# EAGLE design PocaSeek (EAGLE 9.6.2)
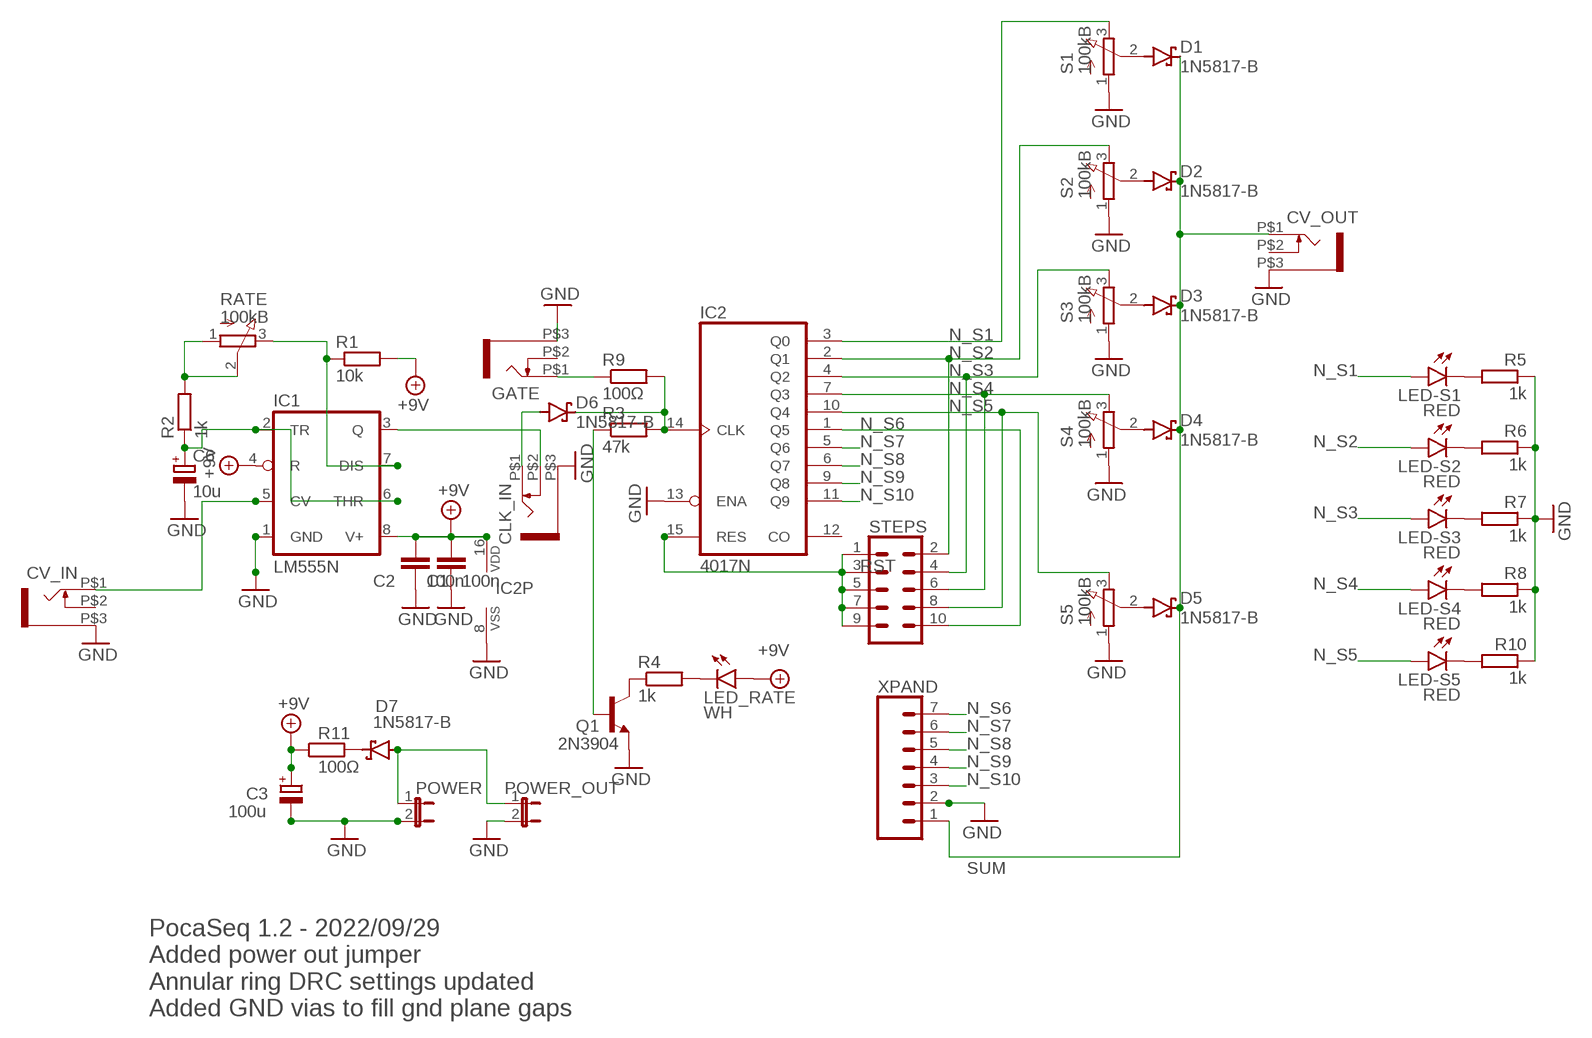
[diagram p0: schematic, sheet 1]

## Parts
C1  100n  C-EU050-024X044  [C050-024X044]
C2  100n  C-EU050-024X044  [C050-024X044]
C3  100u  CPOL-EUE2.5-7  [E2,5-7]
C6  10u  CPOL-EUE2.5-6  [E2,5-6]
CLK_IN  WQP-PJ301M-12_JACK  [WQP-PJ301M-12_JACK]
CV_IN  WQP-PJ301M-12_JACK  [WQP-PJ301M-12_JACK]
CV_OUT  WQP-PJ301M-12_JACK  [WQP-PJ301M-12_JACK]
D1  1N5817-B  [DO41-7.6]
D2  1N5817-B  [DO41-7.6]
D3  1N5817-B  [DO41-7.6]
D4  1N5817-B  [DO41-7.6]
D5  1N5817-B  [DO41-7.6]
D6  1N5817-B  [DO41-7.6]
D7  1N5817-B  [DO41-7.6]
GATE  WQP-PJ301M-12_JACK  [WQP-PJ301M-12_JACK]
IC1  LM555N  [DIL08]
IC2  4017N  [DIL16]
LED-S1  RED  LED3MM  [LED3MM]
LED-S2  RED  LED3MM  [LED3MM]
LED-S3  RED  LED3MM  [LED3MM]
LED-S4  RED  LED3MM  [LED3MM]
LED-S5  RED  LED3MM  [LED3MM]
LED_RATE  WH  LED3MM  [LED3MM]
POWER  JP1E  [JP1]
POWER_OUT  JP1E  [JP1]
Q1  2N3904  [TO92]
R1  10k  R-EU_0204/7  [0204/7]
R2  1k  R-EU_0204/7  [0204/7]
R3  47k  R-EU_0204/7  [0204/7]
R4  1k  R-EU_0204/7  [0204/7]
R5  1k  R-EU_0204/2V  [0204V]
R6  1k  R-EU_0204/2V  [0204V]
R7  1k  R-EU_0204/2V  [0204V]
R8  1k  R-EU_0204/2V  [0204V]
R9  100Ω  R-EU_0204/7  [0204/7]
R10  1k  R-EU_0204/2V  [0204V]
R11  100Ω  R-EU_0204/7  [0204/7]
RATE  100kB  EVUF3M  [EVUFXM]
S1  100kB  EVUF3M  [EVUFXM]
S2  100kB  EVUF3M  [EVUFXM]
S3  100kB  EVUF3M  [EVUFXM]
S4  100kB  EVUF3M  [EVUFXM]
S5  100kB  EVUF3M  [EVUFXM]
STEPS  CONN_05X2PTH  [2X5]
XPAND  CONN_07LOCK  [1X07_LOCK]

## Nets
+9V: C1.1 C2.1 C3.+ IC1.4(R) IC1.8(V+) IC2.16(VDD) LED_RATE.A R1.2 R11.1
GND: C1.2 C2.2 C3.- C6.- CLK_IN.P$3 CV_IN.P$3 CV_OUT.P$3 GATE.P$3 IC1.1(GND) IC2.8(VSS) IC2.13(ENA) POWER.2 POWER_OUT.2 Q1.3(E) R5.1 R6.1 R7.1 R8.1 R10.1 S1.1(A) S2.1(A) S3.1(A) S4.1(A) S5.1(A) XPAND.2
N$1: D1.A S1.2(S)
N$2: CLK_IN.P$2 IC1.3(Q)
N$3: D2.A S2.2(S)
N$4: D6.C IC2.14(CLK) R3.2 R9.2
N$5: D5.A S5.2(S)
N$6: LED-S1.K(C) R5.2
N$7: GATE.P$1 R9.1
N$8: D3.A S3.2(S)
N$9: D4.A S4.2(S)
N$11: R2.2 RATE.1(A) RATE.2(S)
N$12: LED-S3.K(C) R7.2
N$13: Q1.2(B) R3.1
N$14: CLK_IN.P$1 D6.A
N$15: CV_IN.P$1 IC1.5(CV)
N$16: C6.+ IC1.2(TR) IC1.6(THR) R2.1
N$17: IC1.7(DIS) R1.1 RATE.3(E)
N$18: LED-S4.K(C) R8.2
N$19: Q1.1(C) R4.1
N$20: LED_RATE.K(C) R4.2
N$21: LED-S5.K(C) R10.2
N$22: LED-S2.K(C) R6.2
N$23: D7.C R11.2
N$24: D7.A POWER.1 POWER_OUT.1
N_S1: IC2.3(Q0) LED-S1.A S1.3(E)
N_S2: IC2.2(Q1) LED-S2.A S2.3(E) STEPS.2
N_S3: IC2.4(Q2) LED-S3.A S3.3(E) STEPS.4
N_S4: IC2.7(Q3) LED-S4.A S4.3(E) STEPS.6
N_S5: IC2.10(Q4) LED-S5.A S5.3(E) STEPS.8
N_S6: IC2.1(Q5) STEPS.10 XPAND.7
N_S7: IC2.5(Q6) XPAND.6
N_S8: IC2.6(Q7) XPAND.5
N_S9: IC2.9(Q8) XPAND.4
N_S10: IC2.11(Q9) XPAND.3
RST: IC2.15(RES) STEPS.1 STEPS.3 STEPS.5 STEPS.7 STEPS.9
SUM: CV_OUT.P$1 D1.C D2.C D3.C D4.C D5.C XPAND.1
Unconnected: CV_IN.P$2 CV_OUT.P$2 GATE.P$2 IC2.12(CO)

## Notes on the sheet
- PocaSeq 1.2 - 2022/09/29
  Added power out jumper
  Annular ring DRC settings updated
  Added GND vias to fill gnd plane gaps

## Library data of the parts
C1 C2 = resistor:C-EU: CAPACITOR, European symbol
C3 C6 = rcl:CPOL-EU: POLARIZED CAPACITOR, European symbol
CLK_IN CV_IN CV_OUT GATE = thonkiconn:WQP-PJ301M-12_JACK
D1-D7 = diode:1N581*: 1.0A SCHOTTKY BARRIER RECTIFIER Source: http://www.diodes.com/datasheets/ds23001.pdf
IC1 = linear:*555: TIMER
IC2 = 40xx:4017: COUNTER/DIVIDER
LED-S1-LED-S5 LED_RATE = gm-diodes:LED
POWER POWER_OUT = jumper:JP1E: JUMPER
Q1 = transistor:2N3904: NPN TRANSISTOR
R1-R11 = resistor:R-EU_: RESISTOR, European symbol
RATE S1-S5 = AFA-TUTCOMP:EVU: 9 mm Square Rotary Potentiometers Source: Panasonic
STEPS = SparkFun-Connectors:CONN_05X2: Multi connection point. Often used as Generic Header-pin footprint for 0.1 inch spaced/style header connections For AVR SPI programming port, see special device with nice symbol: "AVR_SPI_PROG_5x2.dev" You can populate with any combo of single row headers, but if you'd like an exact match, check these: 2x5 AVR ICSP Male Header <https://www.sparkfun.com/products/778> (PRT-00778) 2x5 Pin Shrouded Header <https://www.sparkfun.com/products/8506> (PRT-08506) On any of the 0.1 inch spaced packages, you can populate with these: Break Away Headers - Straight <https://www.sparkfun.com/products/116> (PRT-00116) Break Away Male Headers - Right Angle <https://www.sparkfun.com/products/553> (PRT-00553) Female Headers <https://www.sparkfun.com/products/115> (PRT-00115) Break Away Headers - Machine Pin <https://www.sparkfun.com/products/117> (PRT-00117) Break Away Female Headers - Swiss Machine Pin <https://www.sparkfun.com/products/743> (PRT-00743) Special note: the shrouded connector mates well with our 5x2 ribbon cables: 2x5 Pin IDC Ribbon Cable <https://www.sparkfun.com/products/8535> (PRT-08535); PROD_ID: CONN-08499; SF_ID: PRT-0778
XPAND = SparkFun-Connectors:CONN_07: Multi connection point. Often used as Generic Header-pin footprint for 0.1 inch spaced/style header connections On any of the 0.1 inch spaced packages, you can populate with these: Break Away Headers - Straight <https://www.sparkfun.com/products/116> (PRT-00116) Break Away Male Headers - Right Angle <https://www.sparkfun.com/products/553> (PRT-00553) Female Headers <https://www.sparkfun.com/products/115> (PRT-00115) Break Away Headers - Machine Pin <https://www.sparkfun.com/products/117> (PRT-00117) Break Away Female Headers - Swiss Machine Pin <https://www.sparkfun.com/products/743> (PRT-00743) For SCREWTERMINALS and SPRING TERMINALS visit here: Screw Terimnals on SparkFun.com <https://www.sparkfun.com/search/results?term=Screw+Terminals> (5mm/3.5mm/2.54mm spacing) This device is also useful as a general connection point to wire up your design to another part of your project. Our various solder wires solder well into these plated through hole pads. Hook-Up Wire - Assortment (Stranded, 22 AWG) <https://www.sparkfun.com/products/11375> (PRT-11375) Hook-Up Wire - Assortment (Solid Core, 22 AWG) <https://www.sparkfun.com/products/11367> (PRT-11367) View the entire wire category on our website here <https://www.sparkfun.com/categories/141> Special notes: Molex polarized connector foot print use with SKU : PRT-08231 with associated crimp pins and housings. 1MM SMD Version SKU: PRT-10208 NOTES ON THE VARIANTS LOCK and LOCK_LONGPADS... This footprint was designed to help hold the alignment of a through-hole component (i.e. 6-pin header) while soldering it into place. You may notice that each hole has been shifted either up or down by 0.005 of an inch from it's more standard position (which is a perfectly straight line). This slight alteration caused the pins (the squares in the middle) to touch the edges of the holes. Because they are alternating, it causes a "brace" to hold the component in place. 0.005 has proven to be the perfect amount of "off-center" position when using our standard breakaway headers. Although looks a little odd when you look at the bare footprint, once you have a header in there, the alteration is very hard to notice. Also,if you push a header all the way into place, it is covered up entirely on the bottom side.

## Board
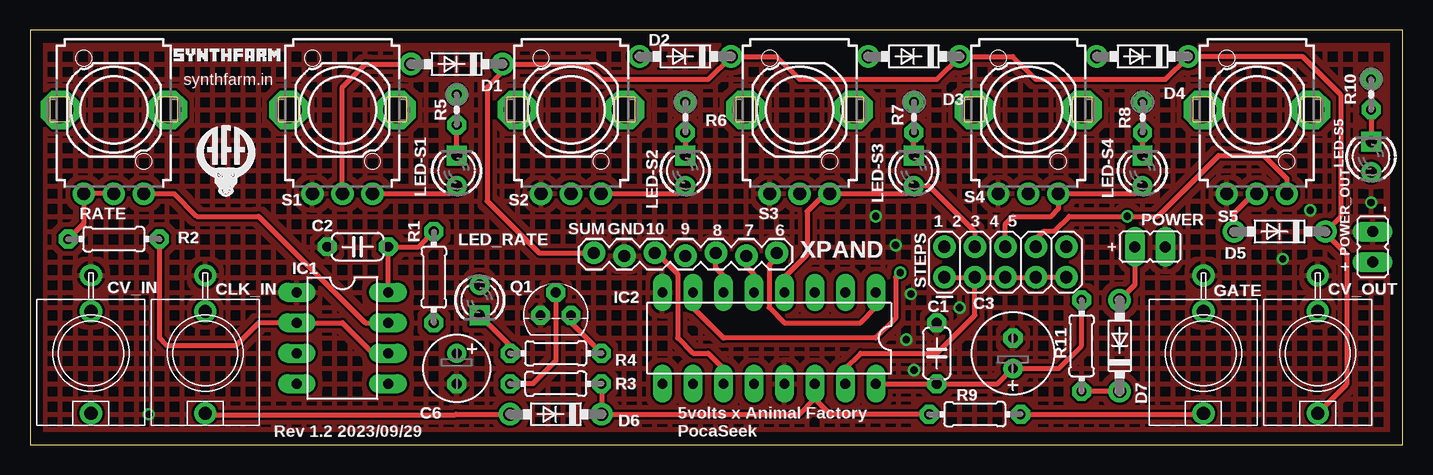
[diagram p1: board, top side]
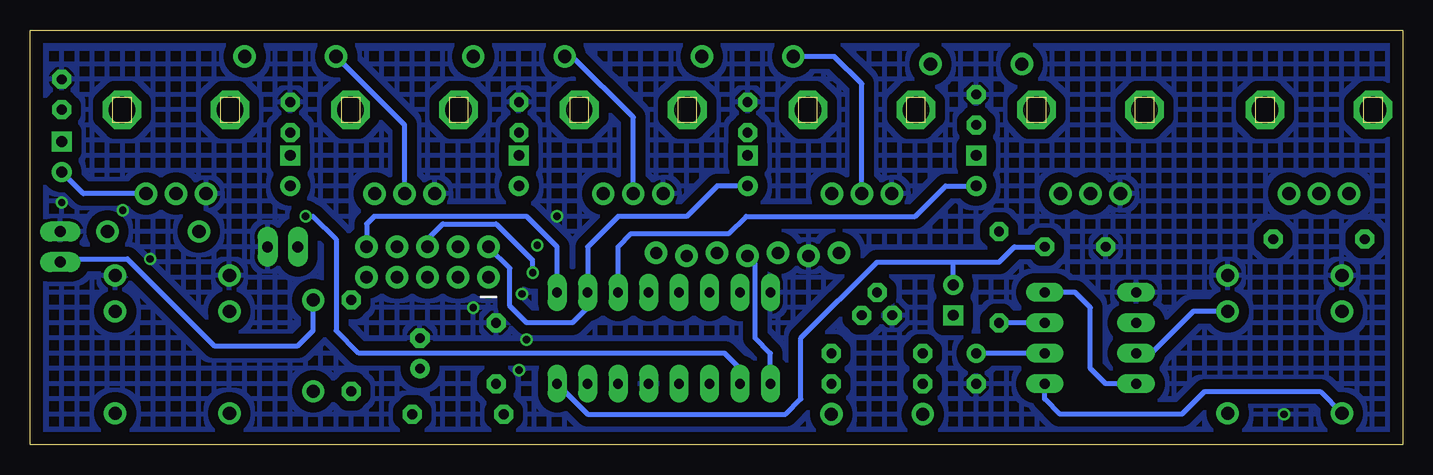
[diagram p2: board, bottom side, seen from below]

Size 114.41 x 34.59 mm. Coordinates in mm from the lower left corner, seen from the top.
Outline: 0,0 114.41,0 114.41,34.59 0,34.59 0,0
Copper layers (1*16): Top 0.035mm / dielectric 1.5mm / Bottom 0.035mm
Design rules "default *": minimum track width 10mil, minimum drill 24mil, track to track 8mil, track to pad 8mil, pad to pad 8mil, via to via 8mil, smd to smd 8mil, copper to edge 40mil, drill to drill 8mil, minimum pad ring 15mil, minimum via ring 8mil, stop-mask expansion 4mil, vias tented up to drill 0mil, thermal gap 10mil

### Footprints (pad centres in the part's own frame; a part is rotated, then mirrored left to right if it is on the bottom)
C050-024X044 = drill 0.813 octagon: 1 -2.54,0; 2 2.54,0
E2,5-7 = drill 0.813 pad 1.6: + -1.27,0 | drill 0.813 pad 1.6 octagon: - 1.27,0
E2,5-6 = drill 0.813 pad 1.6: + -1.27,0 | drill 0.813 pad 1.6 octagon: - 1.27,0
WQP-PJ301M-12_JACK = drill 1.1: P$1 0,5; P$2 0,-3.5; P$3 0,-6.5
DO41-7.6 = drill 1.1 pad 1.7: A 3.81,0; C -3.81,0
DIL08 = drill 0.813 long: 1 -3.81,-3.81; 2 -1.27,-3.81; 3 1.27,-3.81; 4 3.81,-3.81; 5 3.81,3.81; 6 1.27,3.81; 7 -1.27,3.81; 8 -3.81,3.81
DIL16 = drill 0.813 long: 1 -8.89,-3.81; 2 -6.35,-3.81; 3 -3.81,-3.81; 4 -1.27,-3.81; 5 1.27,-3.81; 6 3.81,-3.81; 7 6.35,-3.81; 8 8.89,-3.81; 9 8.89,3.81; 10 6.35,3.81; 11 3.81,3.81; 12 1.27,3.81; 13 -1.27,3.81; 14 -3.81,3.81; 15 -6.35,3.81; 16 -8.89,3.81
LED3MM = drill 0.9: A -1.27,0 | drill 0.9 square: K 1.27,0
JP1 = drill 0.914 long: 1 0,-1.27; 2 0,1.27
TO92 = drill 0.813 octagon: 1 1.27,0; 2 0,1.905; 3 -1.27,0
0204/7 = drill 0.813 octagon: 1 -3.81,0; 2 3.81,0
0204V = drill 0.813 octagon: 1 -1.27,0; 2 1.27,0
EVUFXM = drill 1.1 pad 1.676: 1 -2.5,-7; 2 0,-7; 3 2.5,-7 | drill 2.2 pad 3.2 octagon: M1 4.5,0; M2 -4.5,0
2X5 = drill 1.016 pad 1.88: 1 0,0; 2 0,2.54; 3 2.54,0; 4 2.54,2.54; 5 5.08,0; 6 5.08,2.54; 7 7.62,0; 8 7.62,2.54; 9 10.16,0; 10 10.16,2.54
1X07_LOCK = drill 1.016 pad 1.88: 1 0,0.127; 2 2.54,-0.127; 3 5.08,0.127; 4 7.62,-0.127; 5 10.16,0.127; 6 12.7,-0.127; 7 15.24,0.127

### Placement (x,y rotation side)
C1  75.56,7.62 90 top
C2  27.3,16.51 180 top
C3  81.92,7.62 90 top
C6  35.56,6.35 270 top
CLK_IN  14.61,7.62 180 top
CV_IN  5.08,7.62 180 top
CV_OUT  107.31,7.62 180 top
D1  35.56,31.75 180 top
D2  54.61,32.38 180 top
D3  73.66,32.38 180 top
D4  92.71,32.38 180 top
D5  104.14,17.78 180 top
D6  43.81,2.54 180 top
D7  90.81,8.26 90 top
GATE  97.79,7.62 180 top
IC1  26.04,8.89 270 top
IC2  61.59,8.89 180 top
LED-S1  35.56,22.86 90 top
LED-S2  54.61,22.86 90 top
LED-S3  73.66,22.86 90 top
LED-S4  92.71,22.86 90 top
LED-S5  111.76,24 90 top
LED_RATE  37.47,12.06 270 top
POWER  93.34,16.51 270 top
POWER_OUT  111.89,16.51 0 top
Q1  43.81,10.79 0 top
R1  33.66,13.97 90 top
R2  6.99,17.14 180 top
R3  43.81,5.08 0 top
R4  43.81,7.62 180 top
R5  35.56,27.94 270 top
R6  54.61,27.3 270 top
R7  73.66,27.3 270 top
R8  92.71,27.3 270 top
R9  78.74,2.54 180 top
R10  111.76,29.21 270 top
R11  87.63,8.26 270 top
RATE  6.99,27.94 0 top
S1  26.04,27.94 0 top
S2  45.09,27.94 0 top
S3  64.14,27.94 0 top
S4  83.19,27.94 0 top
S5  102.23,27.94 0 top
STEPS  76.2,13.97 0 top
XPAND  46.99,15.88 0 top

### Tracks (layer width: path | path; a pad name or v marks a point on that pad's centre or on a via)
+9V
  Top 0.406: IC2.16 C1.1 80.64,5.08 C3.+ 85.72,6.35 87.63,8.26 R11.1 | IC1.8 C2.1 32.38,16.51 R1.2
  Bottom 0.406: IC1.4 24.77,5.08 26.04,6.35 26.04,11.43 27.3,12.7 IC1.8 | IC2.16 67.94,2.54 51.44,2.54 50.16,3.81 50.16,8.89 43.81,15.24 37.47,15.24 | C2.1 32.38,16.51 33.66,15.24 37.47,15.24 | LED_RATE.A 37.47,15.24
GND  (via drill 0.61)
  other vias: 73.03,8.76 73.66,6.22 77.47,11.43 70.48,19.05 9.91,2.54 72.14,16.64 73.41,12.57 104.39,15.49 111.76,20.19 106.68,19.56
  pour Bottom (isolate 0.813, hatched): 0.64,34.29 0.64,0 114.3,0 114.3,34.29
  pour Top (hatched): 114.3,34.29 0.64,34.29 0.64,0 arc1 114.3,0
N$1
  Top 0.406: S1.2 26.04,29.84 27.94,31.75 D1.A
N$2
  Bottom 0.406: CLK_IN.P$2 17.45,11.12 20.95,7.62 IC1.3
N$3
  Bottom 0.406: S2.2 45.09,30.1 47.37,32.38 D2.A
N$4
  Top 0.406: 65.41,3.81 64.14,2.54 D6.C R3.2 | 65.41,3.81 IC2.14 | R9.2 66.67,2.54 65.41,3.81
N$5
  Top 0.406: S5.2 101.98,20.94 100.33,19.29 D5.A
N$6
  Top 0.406: LED-S1.K R5.2
N$7
  Top 0.406: GATE.P$1 97.71,2.54 R9.1
N$8
  Bottom 0.406: S3.2 64.14,27.3 69.22,32.38 D3.A
N$9
  Bottom 0.406: S4.2 83.19,26.67 D4.A
N$11
  Top 0.406: R2.2 4.49,18.45 RATE.1 RATE.2
N$12
  Top 0.406: LED-S3.K R7.2
N$13
  Top 0.406: Q1.2 43.81,6.99 41.91,5.08 R3.1
N$14
  Top 0.406: CLK_IN.P$1 14.72,2.5 35.47,2.5 35.51,2.54 D6.A
N$15
  Bottom 0.406: IC1.5 29.84,3.81 28.57,2.54 18.41,2.54 16.51,4.45 6.91,4.45 CV_IN.P$1
N$16
  Top 0.406: IC1.6 28.57,7.62 26.04,10.16 IC1.2 19.05,10.16 17.14,8.26 11.43,8.26 10.79,8.89 R2.1
  Bottom 0.406: IC1.6 C6.+
N$17
  Top 0.406: RATE.3 12.03,20.94 13.91,19.05 19.05,19.05 27.94,10.16 IC1.7
  Bottom 0.406: IC1.7 R1.1
N$18
  Top 0.406: LED-S4.K R8.2
N$19
  Top 0.406: R4.1 45.09,10.16 Q1.1
N$20
  Top 0.406: LED_RATE.K 40.01,8.26 R4.2
N$21
  Top 0.406: R10.2 LED-S5.K
N$22
  Top 0.406: R6.2 LED-S2.K
N$23
  Top 0.406: D7.C R11.2
N$24
  Top 0.406: POWER.1 92.08,13.34 D7.A
  Bottom 0.406: POWER_OUT.1 111.63,15.49 106.3,15.49 99.06,8.26 92.08,8.26 90.81,9.53 D7.A
N_S1
  Top 0.406: S1.3 34.91,20.94 LED-S1.A
  Bottom 0.406: IC2.3 65.41,16.51 64.31,17.6 56.18,17.6 54.73,19.05 40.64,19.05 38.1,21.59 LED-S1.A
N_S2
  Top 0.406: S2.3 53.96,20.94 LED-S2.A
  Bottom 0.406: LED-S2.A 57.15,21.59 59.69,19.05 65.41,19.05 67.94,16.51 IC2.2 67.94,11.43 69.22,10.16 73.03,10.16 74.42,11.56 74.42,14.73 STEPS.2
N_S3
  Top 0.406: STEPS.4 78.74,17.78 74.93,21.59 LED-S3.A 73.01,20.94 S3.3 66.25,20.94 64.77,19.46 64.77,15.88 62.87,13.97 IC2.4
N_S4  (via drill 0.61)
  Top 0.406: S4.3 85.72,20.94 | 85.72,20.94 92.06,20.94 LED-S4.A | IC2.7 55.24,11.43 57.78,8.89 70.48,8.89 72.14,10.54 72.14,13.97 v72.52,14.35 | STEPS.6 81.28,18.41 81.92,19.05 85.09,19.05 85.72,19.68 85.72,20.94
  Bottom 0.406: v72.52,14.35 72.52,15.37 75.56,18.41 80.01,18.41 81.28,17.14 STEPS.6
N_S5  (via drill 0.61)
  Top 0.406: S5.3 104.73,22.21 102.81,24.13 99.06,24.13 93.98,19.05 v91.44,19.05 86.59,19.05 85.34,17.8 84.48,17.8 83.82,17.14 STEPS.8
  Bottom 0.406: S5.3 109.97,20.94 LED-S5.A | IC2.10 55.24,6.35 56.52,7.62 87,7.62 88.9,9.53 88.9,17.14 90.81,19.05 v91.44,19.05
N_S6
  Top 0.406: IC2.1 70.48,11.43 69.22,10.16 62.87,10.16 61.59,11.43 61.59,14.99 62.23,15.62 XPAND.7
  Bottom 0.406: IC2.1 70.48,16.51 73.03,19.05 85.72,19.05 86.36,18.41 STEPS.10
N_S7
  Top 0.406: IC2.5 60.33,14.22 59.69,14.86 XPAND.6
N_S8
  Top 0.406: IC2.6 57.78,14.1 57.15,14.73 XPAND.5
N_S9
  Bottom 0.406: IC2.9 52.7,7.62 53.98,8.89 53.98,15.11 XPAND.4
N_S10
  Top 0.406: IC2.11 57.78,6.35 56.52,7.62 55.24,7.62 53.98,8.89 53.98,14.25 52.22,16 XPAND.3
RST
  Top 0.406: IC2.15 67.94,6.35 69.22,7.62 75.56,7.62 78.74,10.79 STEPS.3 | STEPS.1 STEPS.3 | STEPS.3 STEPS.5 STEPS.7 STEPS.9
SUM
  Top 0.406: CV_OUT.P$1 109.73,5.03 109.73,15.88 107.95,17.65 D5.C 109.22,19.05 109.22,29.21 106.05,32.38 D4.C 94.61,30.48 83.82,30.48 81.92,32.38 D3.C 75.56,30.48 64.14,30.48 62.23,32.38 D2.C 56.52,30.48 47.62,30.48 46.35,31.75 D1.C 39.37,31.11 38.1,29.84 38.1,20.32 42.42,16 XPAND.1

### Text on the board
tPlace: synthfarm.in | - | SUM | GND | 10 | 9 | 1 2 3 4 5 | 8 | 7 | 6 | + | +
tNames: Rev 1.2 2023/09/29 | 5volts x Animal Factory / PocaSeek
_tPlace: RATE | S1 | S2 | S4 | S3 | CV_IN | CLK_IN | GATE | CV_OUT
_tNames: D2 | R10 | D1 | D4 | R5 | D3 | R7 | R8 | R6 | LED-S1 | LED-S5 | LED-S4 | LED-S2 | LED-S3 | C2 | S5 | LED_RATE | POWER | R2 | R1 | XPAND | D5 | POWER_OUT | IC1 | Q1 | IC2 | STEPS | C1 | C3 | R11 | R4 | R3 | R9 | D7 | C6 | D6